# EAGLE design early-bird (EAGLE 6.5.0)
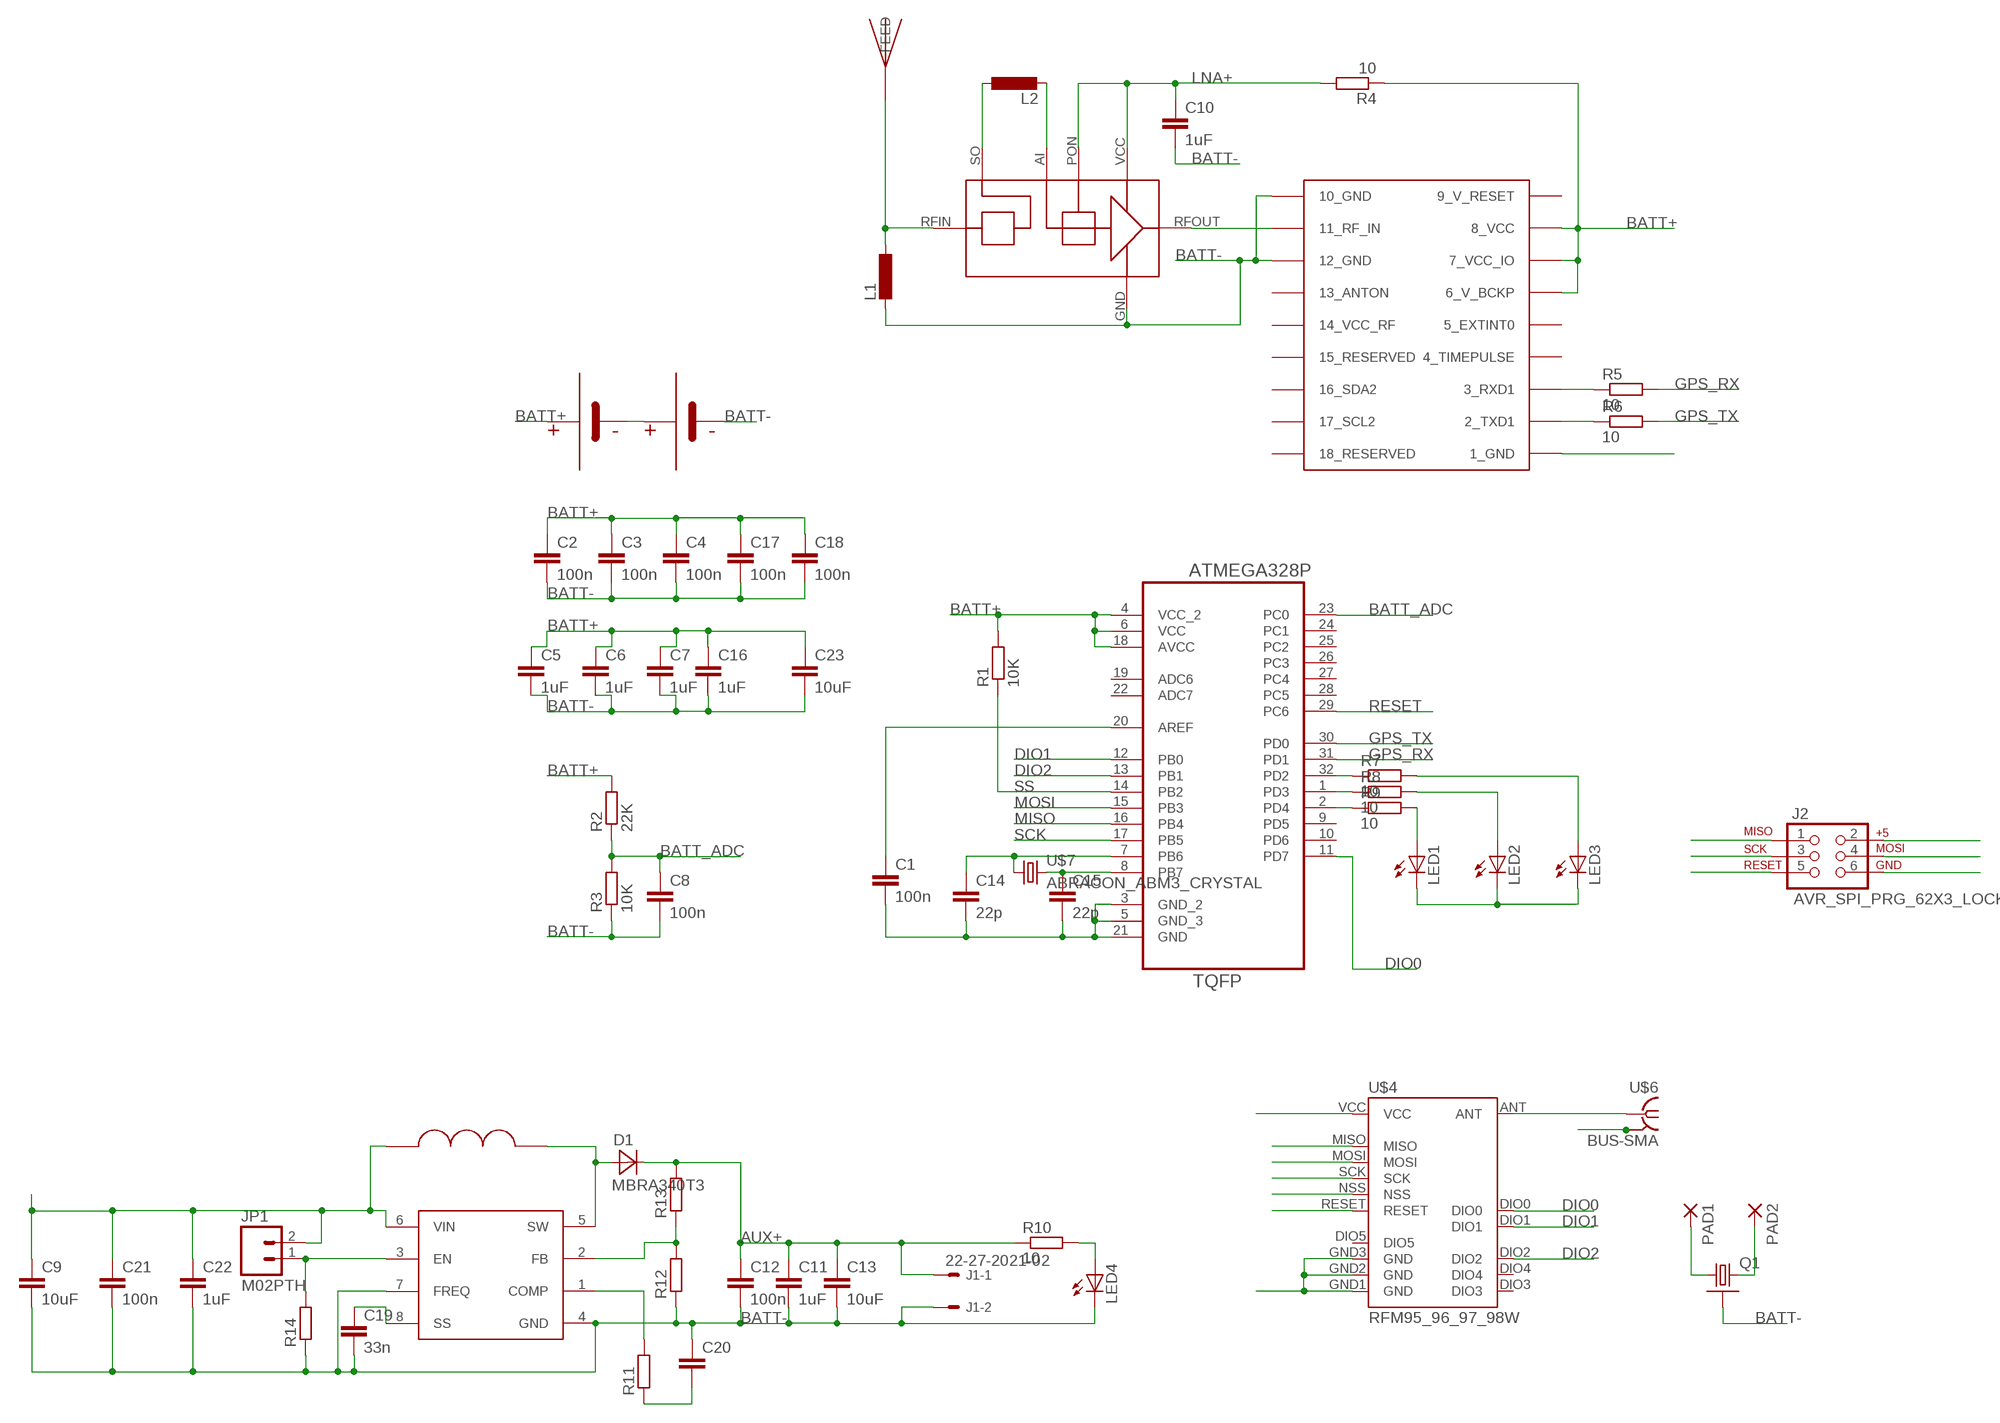
[diagram p0: schematic, sheet 1]

## Parts
C1  100n  C-EUC0402  [C0402]
C2  100n  C-EUC0402  [C0402]
C3  100n  C-EUC0402  [C0402]
C4  100n  C-EUC0402  [C0402]
C5  1uF  C-EUC0603  [C0603]
C6  1uF  C-EUC0603  [C0603]
C7  1uF  C-EUC0603  [C0603]
C8  100n  C-EUC0402  [C0402]
C9  10uF  C-EUC1210  [C1210]
C10  1uF  C-EUC0603  [C0603]
C11  1uF  C-EUC0603  [C0603]
C12  100n  C-EUC0402  [C0402]
C13  10uF  C-EUC1210  [C1210]
C14  22p  C-EUC0402  [C0402]
C15  22p  C-EUC0402  [C0402]
C16  1uF  C-EUC0603  [C0603]
C17  100n  C-EUC0402  [C0402]
C18  100n  C-EUC0402  [C0402]
C19  33n  C-EUC0402  [C0402]
C20  C-EUC0402  [C0402]
C21  100n  C-EUC0402  [C0402]
C22  1uF  C-EUC0603  [C0603]
C23  10uF  C-EUC1210  [C1210]
D1  MBRA340T3  [SMA]
J1  22-27-2021-02  [6410-02]
J2  AVR_SPI_PRG_62X3_LOCK  [2X3_LOCK]
JP1  M02PTH  [1X02]
L1  L-EUL2012C  [L2012C]
L2  L-EUL2012C  [L2012C]
LED1  LEDCHIPLED_1206  [CHIPLED_1206]
LED2  LEDCHIPLED_1206  [CHIPLED_1206]
LED3  LEDCHIPLED_1206  [CHIPLED_1206]
LED4  LEDCHIPLED_1206  [CHIPLED_1206]
PAD1  SMD2  [SMD1,27-2,54]
PAD2  SMD2  [SMD1,27-2,54]
Q1  CRYSTALCTS406  [CTS406]
R1  10K  R-EU_R0402  [R0402]
R2  22K  R-EU_R0402  [R0402]
R3  10K  R-EU_R0402  [R0402]
R4  10  R-EU_R0402  [R0402]
R5  10  R-EU_R0402  [R0402]
R6  10  R-EU_R0402  [R0402]
R7  10  R-EU_R0402  [R0402]
R8  10  R-EU_R0402  [R0402]
R9  10  R-EU_R0402  [R0402]
R10  10  R-EU_R0402  [R0402]
R11  R-EU_R0402  [R0402]
R12  R-EU_R0402  [R0402]
R13  R-EU_R0402  [R0402]
R14  R-EU_R0402  [R0402]
U1  ATMEGA328P-AU  [QFP80P900X900X120-32N]
U$1  KEYSTONE-92-AA-BATTERY-HOLDER  [KEYSTONE-92-AA-BATTERY]
U$2  KEYSTONE-92-AA-BATTERY-HOLDER  [KEYSTONE-92-AA-BATTERY]
U$3  JTI_ANTENNA-1575AT43A40  [JTI_ANTENNA-1575AT43A40]
U$4  RFM95_96_97_98W  [RFM95_96_97_98W]
U$5  UBLOX_MAX  [UBLOX_MAX]
U$6  BUS-SMA  [BUS-SMA]
U$7  ABRACON_ABM3_CRYSTAL  [ABRACON_ABM3_CRYSTAL]
U$8  ADP1612  [SOP65P490X110-8N]
U$9  BGM1034N7  [TSNP-7-10]
U$10  MULTICOMP_8MM_INDUCTOR  [8MM_SQ_INDUCTOR]

## Nets
AUX+: C11.1 C12.1 C13.1 D1.C J1.1 R10.1 R13.2
BATT+: C2.1 C3.1 C4.1 C5.1 C6.1 C7.1 C9.1 C16.1 C17.1 C18.1 C21.1 C22.1 C23.1 J2.2 JP1.2 R1.2 R2.2 R4.1 U1.4(VCC_2) U1.6(VCC) U1.18(AVCC) U$1.VBATT1(BATT+) U$1.VBATT(BATT+) U$4.VCC U$5.6_V_BCKP U$5.7_VCC_IO U$5.8_VCC U$8.6(VIN) U$10.P$2
BATT-: C1.2 C2.2 C3.2 C4.2 C5.2 C6.2 C7.2 C8.2 C9.2 C10.2 C11.2 C12.2 C13.2 C14.2 C15.2 C16.2 C17.2 C18.2 C19.2 C20.1 C21.2 C22.2 C23.2 J1.2 J2.6 L1.2 LED1.C LED2.C LED3.C LED4.C Q1.2 Q1.4 R3.1 R12.1 R14.1 U1.3(GND_2) U1.5(GND_3) U1.21(GND) U$2.GND2(BATT-) U$2.GND(BATT-) U$4.GND1(GND) U$4.GND2(GND) U$4.GND3(GND) U$5.1_GND U$5.10_GND U$5.12_GND U$6.2(GND) U$6.3(GND) U$6.4(GND) U$6.5(GND) U$8.4(GND) U$8.7(FREQ) U$9.GND
BATT_ADC: C8.1 R2.1 R3.2 U1.23(PC0)
DIO0: U1.11(PD7) U$4.DIO0
DIO1: U1.12(PB0) U$4.DIO1
DIO2: U1.13(PB1) U$4.DIO2
GPS_RX: R5.2 U1.31(PD1)
GPS_TX: R6.2 U1.30(PD0)
LNA+: C10.1 R4.2 U$9.PON U$9.VCC
MISO: J2.1 U1.16(PB4) U$4.MISO
MOSI: J2.4 U1.15(PB3) U$4.MOSI
N$1: U$4.ANT U$6.1
N$2: L1.1 U$3.FEED U$9.RFIN
N$3: LED3.A R7.2
N$4: LED2.A R8.2
N$5: C20.2 R11.1
N$6: R5.1 U$5.3_RXD1
N$7: R6.1 U$5.2_TXD1
N$8: C1.1 U1.20(AREF)
N$9: JP1.1 R14.2 U$8.3(EN)
N$10: R7.1 U1.32(PD2)
N$11: L2.1 U$9.SO
N$12: R8.1 U1.1(PD3)
N$13: R9.1 U1.2(PD4)
N$14: LED1.A R9.2
N$15: LED4.A R10.2
N$16: U$1.GND2(BATT-) U$1.GND(BATT-) U$2.VBATT1(BATT+) U$2.VBATT(BATT+)
N$17: C15.1 U1.8(PB7) U$7.P$2
N$18: C14.1 U1.7(PB6) U$7.P$1
N$19: C19.1 U$8.8(SS)
N$20: R11.2 U$8.1(COMP)
N$21: R12.2 R13.1 U$8.2(FB)
N$22: PAD1.1(P) Q1.1
N$23: D1.A U$8.5(SW) U$10.P$1
N$24: L2.2 U$9.AI
N$25: U$5.11_RF_IN U$9.RFOUT
N$26: PAD2.1(P) Q1.3
RADIO_RESET: U$4.RESET
RESET: J2.5 U1.29(PC6)
SCK: J2.3 U1.17(PB5) U$4.SCK
SS: R1.1 U1.14(PB2) U$4.NSS
Unconnected: U1.9(PD5) U1.10(PD6) U1.19(ADC6) U1.22(ADC7) U1.24(PC1) U1.25(PC2) U1.26(PC3) U1.27(PC4) U1.28(PC5) U$4.DIO3 U$4.DIO4 U$4.DIO5 U$5.4_TIMEPULSE U$5.5_EXTINT0 U$5.13_ANTON U$5.14_VCC_RF U$5.15_RESERVED U$5.16_SDA2 U$5.17_SCL2 U$5.18_RESERVED

## Power pins joined to a net without a drawn wire
9_V_RESET: U$5.9_V_RESET

## Library data of the parts
C1-C23 = resistor:C-EU: CAPACITOR, European symbol
D1 = diode:MBRA340T3: Surface Mount Schottky Power Rectifier Source: http://www.onsemi.com/pub_link/Collateral/MBRA340T3-D.PDF
J1 = con-molex:22-?-02: CONNECTOR wire to board 2.54 mm (.1 inch) pitch header; OC_FARNELL: unknown; OC_NEWARK: unknown
J2 = SparkFun-Connectors:AVR_SPI_PRG_6: AVR ISP 6 Pin This is the reduced ISP connector for AVR programming. Common on Arduino. This footprint will take up less PCB space and can be used with a 10-pin to 6-pin adapter such as SKU: BOB-08508 **Special note about "TEST_POINT" package. The stop mask is on the top side, so if you want your programming test points to be on the bottom of your board, make sure to place this package on the bottom side of the board. This also ensure that the orientation to program from the bottom side will be correct.
JP1 = SparkFun-Connectors:M02: Standard 2-pin 0.1" header. Use with - straight break away headers ( PRT-00116) - right angle break away headers (PRT-00553) - swiss pins (PRT-00743) - machine pins (PRT-00117) - female headers (PRT-00115) Molex polarized connector foot print use with: PRT-08233 with associated crimp pins and housings. 2.54_SCREWTERM for use with PRT-10571. 3.5mm Screw Terminal footprints for PRT-08084 5mm Screw Terminal footprints for use with PRT-08432
L1 L2 = resistor:L-EU: INDUCTOR, European symbol
LED1-LED4 = led:LED: LED OSRAM: - CHIPLED LG R971, LG N971, LY N971, LG Q971, LY Q971, LO R971, LY R971 LH N974, LH R974 LS Q976, LO Q976, LY Q976 LO Q996 - Hyper CHIPLED LW Q18S LB Q993, LB Q99A, LB R99A - SideLED LS A670, LO A670, LY A670, LG A670, LP A670 LB A673, LV A673, LT A673, LW A673 LH A674 LY A675 LS A676, LA A676, LO A676, LY A676, LW A676 LS A679, LY A679, LG A679 - Hyper Micro SIDELED® LS Y876, LA Y876, LO Y876, LY Y876 LT Y87S - SmartLED LW L88C, LW L88S LB L89C, LB L89S, LG L890 LS L89K, LO L89K, LY L89K LS L896, LA L896, LO L896, LY L896 - TOPLED LS T670, LO T670, LY T670, LG T670, LP T670 LSG T670, LSP T670, LSY T670, LOP T670, LYG T670 LG T671, LOG T671, LSG T671 LB T673, LV T673, LT T673, LW T673 LH T674 LS T676, LA T676, LO T676, LY T676, LB T676, LH T676, LSB T676, LW T676 LB T67C, LV T67C, LT T67C, LS T67K, LO T67K, LY T67K, LW E67C LS E67B, LA E67B, LO E67B, LY E67B, LB E67C, LV E67C, LT E67C LW T67C LS T679, LY T679, LG T679 LS T770, LO T770, LY T770, LG T770, LP T770 LB T773, LV T773, LT T773, LW T773 LH T774 LS E675, LA E675, LY E675, LS T675 LS T776, LA T776, LO T776, LY T776, LB T776 LHGB T686 LT T68C, LB T68C - Hyper Mini TOPLED® LB M676 - Mini TOPLED Santana® LG M470 LS M47K, LO M47K, LY M47K Source: http://www.osram.convergy.de LUXEON: - LUMILED® LXK2-PW12-R00, LXK2-PW12-S00, LXK2-PW14-U00, LXK2-PW14-V00 LXK2-PM12-R00, LXK2-PM12-S00, LXK2-PM14-U00 LXK2-PE12-Q00, LXK2-PE12-R00, LXK2-PE12-S00, LXK2-PE14-T00, LXK2-PE14-U00 LXK2-PB12-K00, LXK2-PB12-L00, LXK2-PB12-M00, LXK2-PB14-N00, LXK2-PB14-P00, LXK2-PB14-Q00 LXK2-PR12-L00, LXK2-PR12-M00, LXK2-PR14-Q00, LXK2-PR14-R00 LXK2-PD12-Q00, LXK2-PD12-R00, LXK2-PD12-S00 LXK2-PH12-R00, LXK2-PH12-S00 LXK2-PL12-P00, LXK2-PL12-Q00, LXK2-PL12-R00 Source: www.luxeon.com KINGBRIGHT: KA-3528ASYC Source: www.kingbright.com
PAD1 PAD2 = wirepad:SMD2: SMD PAD
Q1 = crystal:CRYSTAL: CRYSTAL; OC_FARNELL: unknown; OC_NEWARK: unknown
R1-R14 = resistor:R-EU_: RESISTOR, European symbol
U1 = Ava:ATMEGA328P-AU; DESCRIPTION: 8-bit Microcontroller with In-System Programmable Flash; MPN: ATMEGA328P-AU; OC_FARNELL: 1715486; OC_NEWARK: 14R4631; PACKAGE: TQFP-32; SUPPLIER: Atmel
U$1 U$2 = Ava:KEYSTONE-92-AA-BATTERY-HOLDER
U$3 = Ava:JTI_ANTENNA-1575AT43A40
U$4 = Ava:RFM95_96_97_98W
U$5 = Ava:UBLOX_MAX: UBLOX MAX
U$6 = Ava:BUS-SMA
U$7 = Ava:ABRACON_ABM3_CRYSTAL
U$8 = Ava:ADP1612
U$9 = Ava:BGM1034N7
U$10 = Ava:MULTICOMP_8MM_INDUCTOR: eg. http://uk.farnell.com/multicomp/mcsdc0805-100mu/inductors-10uh-20-smd/dp/1864173 Datasheet: http://www.farnell.com/datasheets/1679956.pdf

## Net classes
0 default: clearance 0.254 mm

## Board
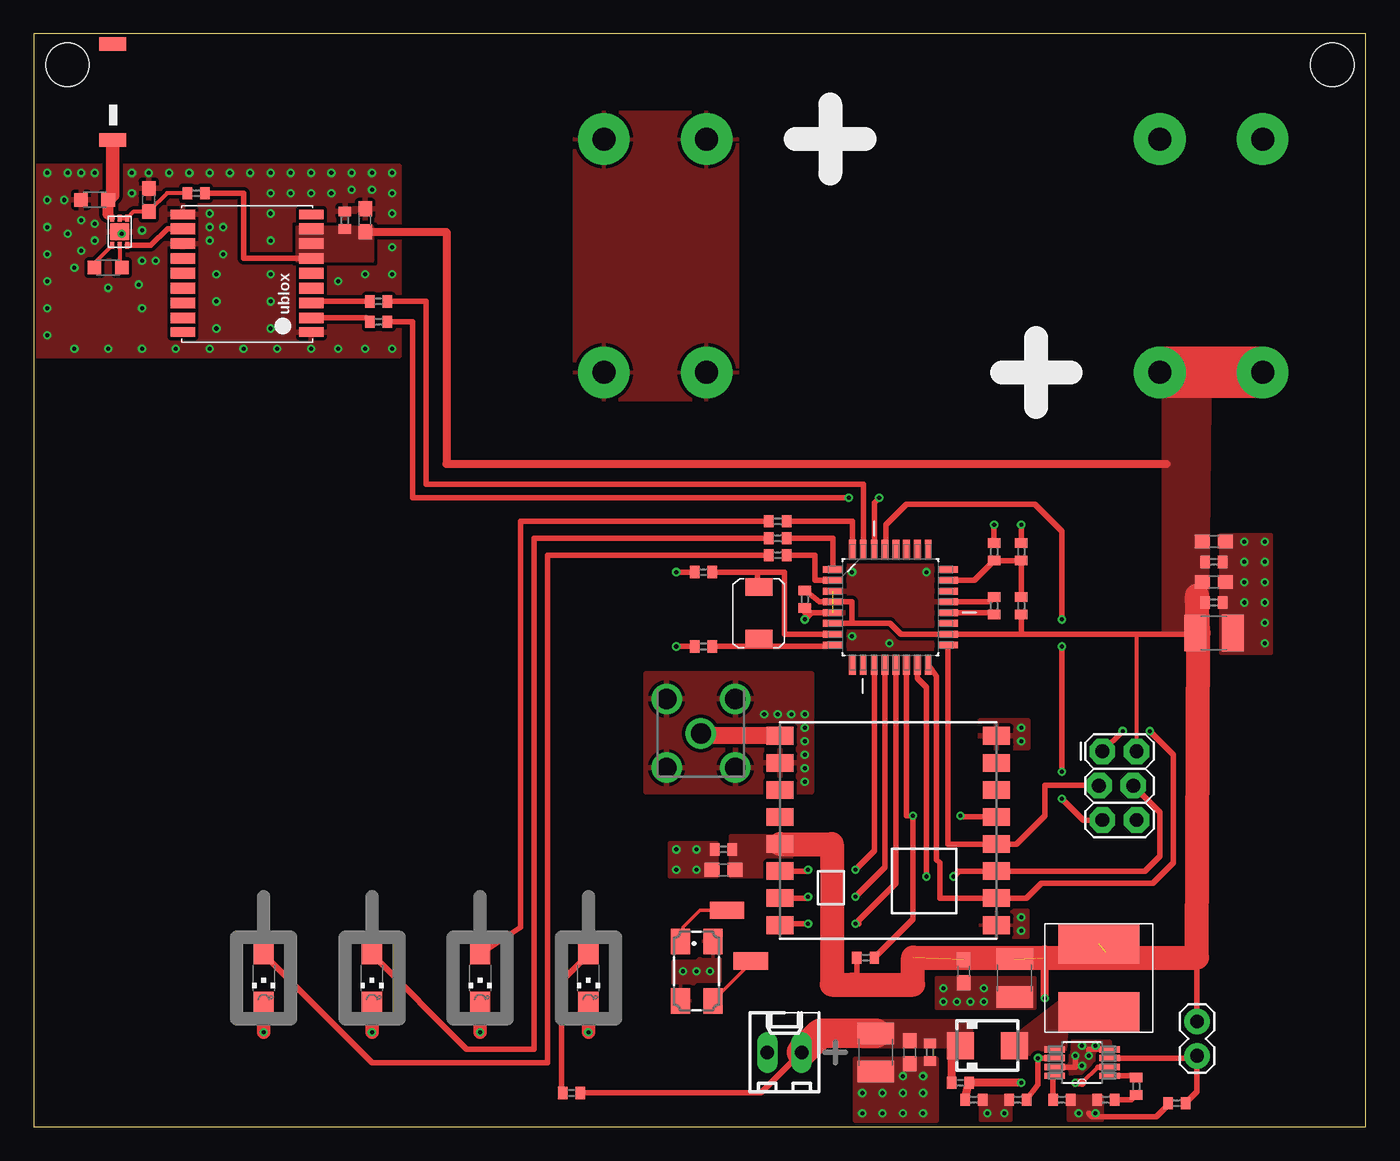
[diagram p1: board, top side]
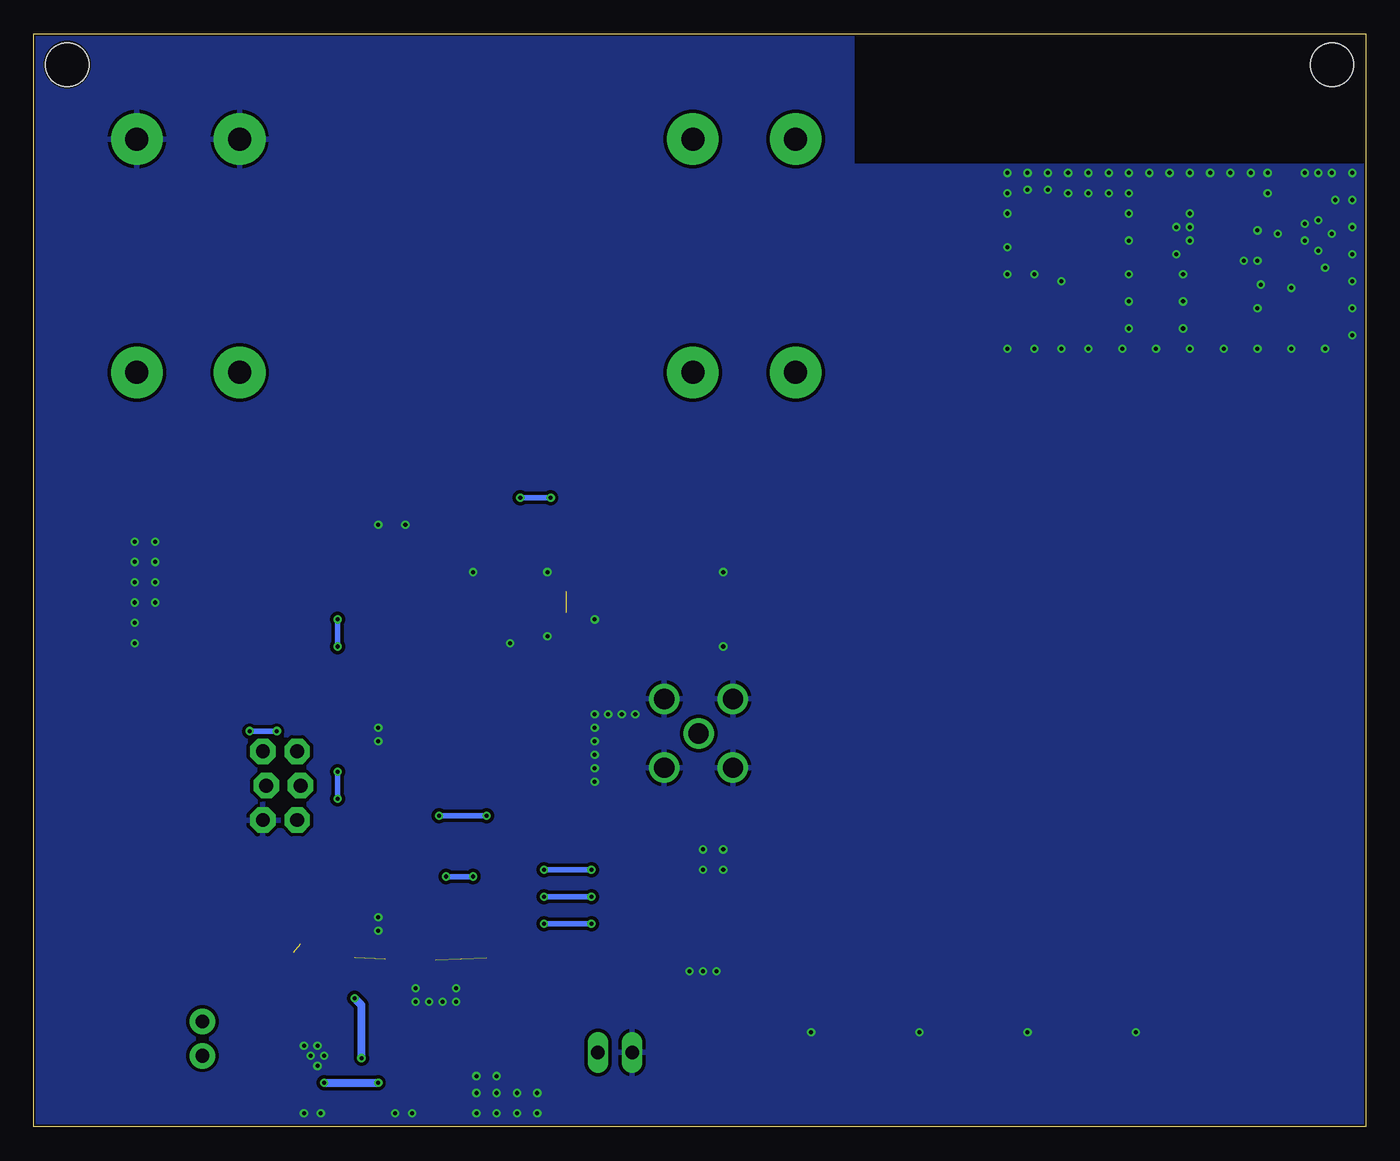
[diagram p2: board, bottom side, seen from below]

Size 98.47 x 80.78 mm. Coordinates in mm from the lower left corner, seen from the top.
Outline: 0,0 98.47,0 98.47,80.78 0,80.78 0,0
Copper layers (1*16): Top 0.035mm / dielectric 1.5mm / Bottom 0.035mm
Design rules "Hackvana": minimum track width 6mil, minimum drill 0.3mm, track to track 6mil, track to pad 6mil, pad to pad 6mil, via to via 6mil, smd to smd 0mil, copper to edge 6mil, drill to drill 6mil, minimum pad ring 10mil, minimum via ring 6mil, stop-mask expansion 2mil, vias tented up to drill 100mil, thermal gap 10mil
Holes 3.2 mm at 2.5,78.5 96,78.5

### Footprints (pad centres in the part's own frame; a part is rotated, then mirrored left to right if it is on the bottom)
C0402 = smd 0.7 x 0.9: 1 -0.65,0; 2 0.65,0
C0603 = smd 1.1 x 1: 1 -0.85,0; 2 0.85,0
C1210 = smd 1.6 x 2.7: 1 -1.4,0; 2 1.4,0
SMA = smd 2 x 2: A 2,0; C -2,0
6410-02 = drill 1.016 long: 1 1.27,0; 2 -1.27,0
2X3_LOCK = drill 1.016 pad 1.88 octagon: 1 0,0; 2 0,2.54; 3 2.54,-0.254; 4 2.54,2.286; 5 5.08,0; 6 5.08,2.54
1X02 = drill 1.016 pad 1.88: 1 0,0; 2 2.54,0
L2012C = smd 1 x 1: 1 -1,0; 2 1,0
CHIPLED_1206 = smd 1.5 x 1.5: A 0,-1.75; C 0,1.75
SMD1,27-2,54 = smd 1.27 x 2.54: 1 0,0
CTS406 = smd 1.9 x 1.4: 1 -2.2,-1.2; 2 2.2,-1.2; 3 2.2,1.2; 4 -2.2,1.2
R0402 = smd 0.7 x 0.9: 1 -0.65,0; 2 0.65,0
QFP80P900X900X120-32N = smd 1.473 x 0.508: 1 -4.242,2.794; 2 -4.242,2.007; 3 -4.242,1.194; 4 -4.242,0.406; 5 -4.242,-0.406; 6 -4.242,-1.194; 7 -4.242,-2.007; 8 -4.242,-2.794; 17 4.242,-2.794; 18 4.242,-2.007; 19 4.242,-1.194; 20 4.242,-0.406; 21 4.242,0.406; 22 4.242,1.194; 23 4.242,2.007; 24 4.242,2.794 | smd 0.508 x 1.473: 9 -2.794,-4.242; 10 -2.007,-4.242; 11 -1.194,-4.242; 12 -0.406,-4.242; 13 0.406,-4.242; 14 1.194,-4.242; 15 2.007,-4.242; 16 2.794,-4.242; 25 2.794,4.242; 26 2.007,4.242; 27 1.194,4.242; 28 0.406,4.242; 29 -0.406,4.242; 30 -1.194,4.242; 31 -2.007,4.242; 32 -2.794,4.242
KEYSTONE-92-AA-BATTERY = drill 1.7 pad 3.81: GND -24.35,0; GND2 -16.75,0; VBATT 16.75,0; VBATT1 24.35,0
JTI_ANTENNA-1575AT43A40 = smd 1 x 2: FEED -3.175,0; NC 3.925,0
RFM95_96_97_98W = smd 2 x 1.3: ANT 8,-7; DIO0 8,3; DIO1 8,5; DIO2 8,7; DIO3 8,-3; DIO4 8,-1; DIO5 -8,-5; GND1 -8,7; GND2 8,-5; GND3 -8,-7; MISO -8,5; MOSI -8,3; NSS -8,-1; RESET -8,-3; SCK -8,1; VCC 8,1
UBLOX_MAX = smd 1.8 x 0.7: 1_GND 4.95,-4.4; 9_V_RESET 4.95,4.3; 10_GND -4.55,4.3; 18_RESERVED -4.55,-4.4 | smd 1.8 x 0.8: 2_TXD1 4.95,-3.35; 3_RXD1 4.95,-2.25; 4_TIMEPULSE 4.95,-1.15; 5_EXTINT0 4.95,-0.05; 6_V_BCKP 4.95,1.05; 7_VCC_IO 4.95,2.15; 8_VCC 4.95,3.25; 11_RF_IN -4.55,3.25; 12_GND -4.55,2.15; 13_ANTON -4.55,1.05; 14_VCC_RF -4.55,-0.05; 15_RESERVED -4.55,-1.15; 16_SDA2 -4.55,-2.25; 17_SCL2 -4.55,-3.35
BUS-SMA = drill 1.5: 1 0,0; 2 -2.54,2.54; 3 2.54,2.54; 4 2.54,-2.54; 5 -2.54,-2.54
ABRACON_ABM3_CRYSTAL = smd 1.3 x 2: P$1 -3.4,0.1; P$2 0.4,0.1
SOP65P490X110-8N = smd 1.524 x 0.457: 1 -2.032,0.965; 2 -2.032,0.33; 3 -2.032,-0.33; 4 -2.032,-0.965; 5 2.032,-0.965; 6 2.032,-0.33; 7 2.032,0.33; 8 2.032,0.965
TSNP-7-10 = smd 0.5 x 0.28: AI 0.85,-0.15; PON -1.15,-0.15; RFIN -1.15,-0.7; RFOUT 0.85,0.4; SO 0.85,-0.7; VCC -1.15,0.4 | smd 1.28 x 1.47: GND -0.15,-0.15
8MM_SQ_INDUCTOR = smd 6 x 3: P$1 0,-2.54; P$2 0,2.54

### Placement (x,y rotation side)
C1  71,38.5 90 top
C2  87.25,41.75 0 top
C3  23,67 90 top
C4  51,20.5 180 top
C5  24.5,67 90 top
C6  87.25,43.25 0 top
C7  51,19 180 top
C8  71,42.5 90 top
C9  72.5,11 270 top
C10  8.5,68.5 90 top
C11  64.75,5.5 270 top
C12  66.25,5.5 270 top
C13  62.25,5.5 270 top
C14  49.5,41 180 top
C15  49.5,35.5 180 top
C16  87.25,40.25 0 top
C17  87.25,38.75 0 top
C18  57,39 270 top
C19  76,2 0 top
C20  79.25,2 0 top
C21  72.75,2 180 top
C22  68.75,11.5 270 top
C23  87.25,36.5 0 top
D1  70.5,6 0 top
J1  55.5,5.5 0 top
J2  79,27.75 270 top
JP1  86,5.25 90 top
L1  4.5,68.5 180 top
L2  5.5,63.5 0 top
LED1  17,11 180 top
LED2  25,11 180 top
LED3  33,11 180 top
LED4  41,11 180 top
PAD1  51.25,16 90 top
PAD2  53,12.25 270 top
Q1  49,11.5 270 top
R1  61.5,12.5 180 top
R2  73,38.5 270 top
R3  73,42.5 270 top
R4  12,69 180 top
R5  25.5,61 0 top
R6  25.5,59.5 0 top
R7  55,44.75 180 top
R8  55,43.5 180 top
R9  55,42.25 180 top
R10  39.75,2.5 180 top
R11  81.5,3 90 top
R12  69.5,2 180 top
R13  68.5,3.25 180 top
R14  84.5,1.75 0 top
U1  63.33,38.4 0 top
U$1  66.5,55.75 0 top
U$2  66.5,73 180 top
U$3  5.84,76.1 90 top
U$4  63.18,21.9 180 top
U$5  15.57,63.13 0 top
U$6  49.32,29.08 270 top
U$7  53.5,36.5 270 top
U$8  77.5,4.75 180 top
U$9  6.5,66 270 top
U$10  78.75,11 0 top

### Tracks (layer width: path | path; a pad name or v marks a point on that pad's centre or on a via)
AUX+
  Top 0.406: R10.1 53.77,2.5 J1.1
  Top 0.61: D1.C 67.85,5.35 R13.2
  Top 2.184: C13.1 58.17,6.9 J1.1
  pour Top (no thermals): 61.25,7.75 69.25,7.75 69.25,6 61.25,6
BATT+  (via drill 0.3 pad 0.25)  (3 unrouted)
  Top 0.254: 79.25,12.5 79.25,12.75 | 79.25,12.75 80.79,12.75 80.5,12.5 | 79.25,12.9 79.25,12.75
  Top 0.305: J2.2 81.54,36.35 81.5,36.39
  Top 0.406: U$5.6_V_BCKP 15.5,64.18 15.5,69 R4.1 | 73,36.39 U1.18 64.11,36.39 63.29,37.21 U1.6 60.5,37.21 60.5,38.81 U1.4 58.09,38.81 C18.1 | R2.2 73,36.39 | R1.2 60.85,10.85 60.5,10.5 | 73,36.39 81.5,36.39 85.98,36.39 86.1,36.51 | U$8.6 v74.25,5.08 74.25,3.1 C21.1 | 86,12.5 JP1.2
  Top 0.61: C5.1 30.5,66.15 30.5,49 83.75,49 | v74.75,9.5 74.75,12.5
  Top 1.778: U$4.VCC 59,20.9 59,10.5 60.5,10.5 65,10.5 65,12.5 74.75,12.5 79.25,12.5 80.5,12.5 86,12.5 86.1,36.51 86,39.25
  Top 3.81: U$1.VBATT U$1.VBATT1
  Bottom 0.61: v74.25,5.08 74.25,9 v74.75,9.5
  pour Top (isolate 0.254, no thermals): 19.5,66.5 25,66.5 25,64 19.5,64
  pour Top (no thermals): 87,57 83.5,57 83.5,36.5 86.75,36.5
  pour Top (no thermals): 56,21.5 51.5,21.5 51.5,18.5 56,18.5
BATT-  (via drill 0.3)  (1 unrouted)
  Top 0.406: C1.2 70.66,38.81 U1.21 | U1.5 57.5,37.99 | 57.5,37.99 v57,37.5 | v71,44.5 C8.2 | v73,44.5 R3.1 | C14.2 v47.5,41 | C15.2 v47.5,35.5 | 57.5,37.99 57,37.99 C18.2 | 78.5,6.17 v78.5,6 | v78,5.25 78,5.71 U$8.4 | R14.1 83.85,1.6 83,0.75 78.25,0.75 78,1 | U$8.7 77,4.42 v77,5.25
  Top 1.016: LED1.C v17,7 | LED2.C v25,7 | LED3.C v33,7 | LED4.C v41,7
  other vias: 3.5,70.5 2.5,70.5 7.25,70.5 4.5,70.5 8.5,70.5 10,70.5 11.5,70.5 13,70.5 14.5,70.5 16,70.5 17.5,70.5 19,70.5 20.5,70.5 22,70.5 23.5,70.5 26.5,63 3,57.5 1,70.5 1,68.5 1,66.5 1,64.5 1,62.5 1,60.5 1,58.5 7.25,69 65.75,1 61.25,1 61.25,2.5 89.5,38.75 91,38.75 89.5,43.25 91,43.25 89.5,41.75 91,41.75 89.5,40.25 91,40.25 66,41 60.5,41 60.5,36.25 63.25,35.75 49,20.5 47.5,20.5 49,19 47.5,19 57,25.5 57,27.5 57,29.5 57,30.5 73,15.5 73,14.5 17.5,65.5 26.5,70.5 25,70.5 3.5,67 17.5,69 19,69 20.5,69 22,69 26.5,69 26.5,67.5 26.5,65 13.5,61 5.5,62 17.5,61 24.5,63 5.5,57.5 14,64.5 26.5,57.5 24.5,57.5 22.5,57.5 23.5,69.25 22.5,62.5 17.5,63 17.5,59 17.5,67.5 13.5,63 13.5,59 13,67.5 62.75,2.5 62.75,1 64.25,1 64.25,2.5 65.75,2.5 73,29.5 73,28.5 57,26.5 57,28.5 55,30.5 54,30.5 56,30.5 77.25,1 8,66.25 6.5,66 4.5,66.75 2.5,66 14,66.5 13,65.5 9,64 8,64 8,60.5 8,57.5 10.5,57.5 13,57.5 15.5,57.5 18,57.5 20.5,57.5 77.5,6 70.25,10.25 70.25,9.25 69.25,9.25 68.25,9.25 67.25,9.25 70.5,1 71.75,1 67.25,10.25 91,37.25 91,35.75 77.5,4.5 25,69.25 78.5,1 4.5,65.5 3.5,64.75 2.25,68.5 49,11.5 48,11.5 50,11.5 3,63.5 7.75,62.25 13,66.5 65.75,3.75 64.25,3.75
  pour Bottom: -0.5,71 38,71 38,81 99,81 99,0 -1,0
  pour Top (rank 2): -0.5,71 -0.5,57 27,57 27,71
  pour Top (no thermals): 87.75,43.75 91.5,43.75 91.5,35 87.75,35
  pour Top: 60,41.75 60,35 67,35 67,42
  pour Top: 45.25,33.5 45.25,24.75 57.5,24.75 57.5,33.5
  pour Top (no thermals): 47,21 47,18.5 50.5,18.5 50.5,21
  pour Top: 73.5,16 70,16 70,14 73.5,14
  pour Top (no thermals): 60.75,5 60.75,0.5 66.75,0.5 66.75,5
  pour Top: 70,30 70,28 73.5,28 73.5,30
  pour Top (rank 2, no thermals): 79.5,6.25 75.5,6.25 75.5,3.25 79.5,3.25
  pour Top (no thermals): 78.5,2.25 76.5,2.25 76.5,0.5 78.5,0.5
  pour Top (no thermals): 74,11 66.75,11 66.75,8.75 74,8.75
  pour Top (no thermals): 72.25,2.25 70,2.25 70,0.5 72.25,0.5
  pour Top (no thermals): 79,2.25 77,2.25 77,0.5 79,0.5
  pour Top: 50.75,14.5 49.5,14.5 49.5,12.75 49,12.25 47.25,12.25 47.25,8.5 48.5,8.5 48.5,10.25 49,10.75 50.75,10.75
BATT_ADC
  Top 0.406: U1.23 69.56,40.41 C8.1 R3.2 R2.1
DIO0  (via drill 0.3 pad 0.25)
  Top 0.406: U$4.DIO0 57.15,18.9 arc90 v57.25,19 | v60.75,19 62.14,20.39 U1.11
  Bottom 0.406: v57.25,19 v60.75,19
DIO1  (via drill 0.3 pad 0.25)
  Top 0.406: U$4.DIO1 57.15,16.9 v57.25,17 | v60.75,17 62.92,19.17 U1.12
  Bottom 0.406: v57.25,17 v60.75,17
DIO2  (via drill 0.3 pad 0.25)
  Top 0.406: U$4.DIO2 arc-90 55.28,15 v57.25,15 | 61,15 v60.75,15 63.74,17.99 U1.13
  Bottom 0.406: v57.25,15 v60.75,15
GPS_RX
  Top 0.406: R5.2 29,61 29,47.5 61.32,47.5 U1.31
GPS_TX  (via drill 0.3)
  Top 0.406: R6.2 28,59.5 28,46.5 v60.25,46.5 | U1.30 62.14,46.14 v62.5,46.5
  Bottom 0.406: v62.5,46.5 v60.25,46.5
LNA+
  Top 0.305: U$9.PON U$9.VCC 7.4,67.65 C10.1 9.85,69 R4.2
MISO  (via drill 0.3 pad 0.25)
  Top 0.406: U1.16 66.75,33.28 66.75,19.75 67,19.5 67,16.9 U$4.MISO 73.4,16.9 74.5,18 82.75,18 84.25,19.5 84.25,27.5 v82.5,29.25 | J2.1 v80.5,29.25
  Bottom 0.406: v80.5,29.25 v82.5,29.25
MOSI  (via drill 0.3)
  Top 0.406: U1.15 65.34,33.16 66,32.5 v66,18.5 | v68,18.5 68.4,18.9 U$4.MOSI 82.15,18.9 83.25,20 83.25,23.25 J2.4
  Bottom 0.406: v66,18.5 v68,18.5
N$1
  Top 1.27: U$4.ANT 49.32,28.9 U$6.1
N$2
  Top 0.406: U$9.RFIN 5.5,67.45
  Top 0.813: 5.5,67.45 L1.1
  Top 1.016: U$3.FEED 5.84,68.84 L1.1
N$3
  Top 0.406: LED3.A 36,14.75 36,44.75 R7.2
N$4
  Top 0.406: R8.2 37,43.5 37,5.75 32,5.75 LED2.A
N$5
  Top 0.406: R11.1 81.15,2 C20.2
N$6
  Top 0.406: U$5.3_RXD1 20.64,61 R5.1
N$7
  Top 0.406: U$5.2_TXD1 24.57,59.78 R6.1
N$8
  Top 0.406: U1.20 70.86,37.99 C1.1
N$9
  Top 0.406: 80.83,5.08 U$8.3 85.83,5.08 JP1.1 86,2.6 R14.2
N$10
  Top 0.406: R7.1 60.54,44.75 U1.32
N$11
  Top 0.305: U$9.SO 4.5,63.85 L2.1
N$12
  Top 0.406: R8.1 59.09,43.5 U1.1
N$13
  Top 0.406: R9.1 57.75,42.25 57.75,40.41 U1.2
N$14
  Top 0.406: R9.2 38,42.25 38,4.75 25,4.75 LED1.A
N$15
  Top 0.406: R10.2 39,2.5 39,10.75 LED4.A
N$16
  pour Top: 40,75 52,75 52,53.75 40,53.75
N$17
  Top 0.406: U1.8 59.09,35.5 53.5,35.5 | 53.5,35.5 C15.1 | U$7.P$2 53.5,36 53.5,35.5
N$18
  Top 0.406: 53.5,41 55.5,41 55.5,36.39 U1.7 | 53.5,41 C14.1 | U$7.P$1 53.5,40 53.5,41
N$19
  Top 0.254: 75.47,3.65 U$8.8
  Top 0.406: 75.47,3.65 75.35,3.53 C19.1
N$20
  Top 0.406: U$8.1 81.36,3.79 R11.2
N$21  (via drill 0.3 pad 0.25)
  Top 0.305: 78.67,4.42 77.5,3.25
  Top 0.406: U$8.2 78.67,4.42
  Top 0.61: R12.2 R13.1 v73,3.25 | 77.5,3.25 v77,3.25
  Bottom 0.61: v77,3.25 v73,3.25
N$22
  Top 0.254: Q1.1 arc90 48,13.9 48,14.75 49.25,16 PAD1.1
N$23
  pour Top (no thermals): 76.25,5.5 76.5,9.75 72.25,6.5 72,6.5 72,5.25
N$24
  Top 0.305: U$9.AI 6.35,63.65 L2.2
N$25
  Top 0.406: U$9.RFOUT 8.65,65.15 9.88,66.38 U$5.11_RF_IN
N$26
  Top 0.254: Q1.3 53,12.1 PAD2.1
RESET  (via drill 0.3, 0.3 pad 0.25)
  Top 0.406: v76,37.5 76,44 74,46 64.5,46 63,44.5 63,42.72 U1.29 | J2.5 77.58,22.67 v76,24.25 | v76,26.25 v76,35.5
  Bottom 0.406: v76,35.5 v76,37.5 | v76,24.25 v76,26.25
SCK
  Top 0.406: U1.17 67.57,20.9 U$4.SCK 72.65,20.9 74.75,23 74.75,25.25 78.71,25.25 J2.3
SS  (via drill 0.3)
  Top 0.406: U1.14 64.52,26.02 64.5,23 v65,23 65,15.35 R1.1 | U$4.NSS 68.6,22.9 v68.5,23
  Bottom 0.406: v65,23 v68.5,23

### Text on the board
tDocu: AA | 9.1nH | 1u | 10R | .1u | 1u | MAX-M8C | 8.2nH | 10R | [BGM1043N7] | 10R | AA | 3x 47R | 1u | .1u | 10K | .1u | .1u | 22p | 1u | .1u | X1 | ATMega328 | 10K | .1u | 22p | 10u | RF | GPS OK | AUX ON | Early Bird | POWER | RF ON | RFM Transceiver | ICSP | .1u | 1u | 10uH | X2 | 10K | 1u | 10u | ENABLE AUX | 10u | 1u | .1u | 10K | 6K8 | 10K | Phil M0DNY - 2014 | https://www.philcrump.co.uk/ | 150R | AUX | 22K | .1u | 33n | 3n3